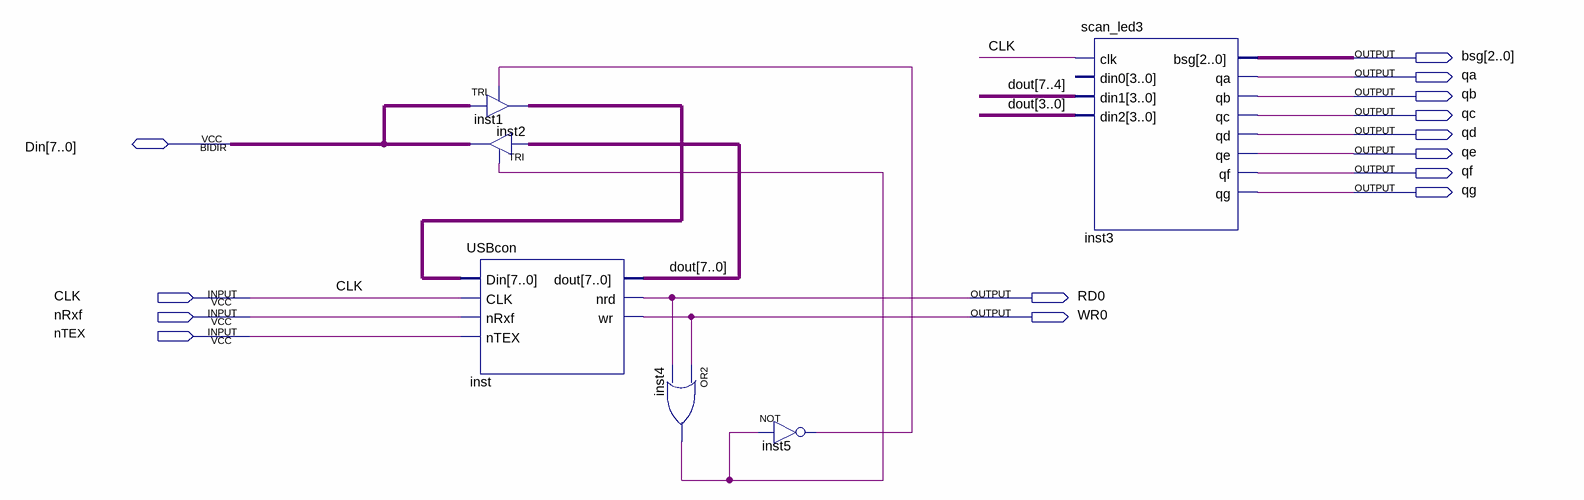
[diagram p0: schematic sheet]
// Quartus schematic USB_top.bdf as structural Verilog: 6 symbols, 14 pins
module USB_top (
  input  CLK,
  input  nRxf,
  input  nTEX,
  inout  [7:0] Din,
  output [2:0] bsg,
  output qa,
  output qb,
  output qc,
  output qd,
  output qe,
  output qf,
  output qg,
  output RD0,
  output WR0
);

  wire inst4_out, inst5_out;
  wire [7:0] dout, inst1_out;

  TRI inst1[7:0] (.IN(Din), .OE(inst5_out), .OUT(inst1_out));
  TRI inst2[7:0] (.IN(dout), .OE(inst4_out), .OUT(Din));
  USBcon inst (.Din(inst1_out), .CLK(CLK), .nRxf(nRxf), .nTEX(nTEX), .dout(dout), .nrd(RD0), .wr(WR0));
  or inst4 (inst4_out, WR0, RD0);
  not inst5 (inst5_out, inst4_out);
  scan_led3 inst3 (
    .clk(CLK), .din1(dout[7:4]), .din2(dout[3:0]), .bsg(bsg), .qa(qa), .qb(qb), .qc(qc), .qd(qd), .qe(qe),
    .qf(qf), .qg(qg));  // open: din0
endmodule
